# Altium schematic sheet Micro_DSUB_IDC.SchDoc: Micro DSUB to IDC
size 420 x 297 mm; ModifiedBy: -; CreateDate: XX/XX/XXXX; CheckedDate: -; Title2: adapter; DivGrp: CTI; Designer: G.K.
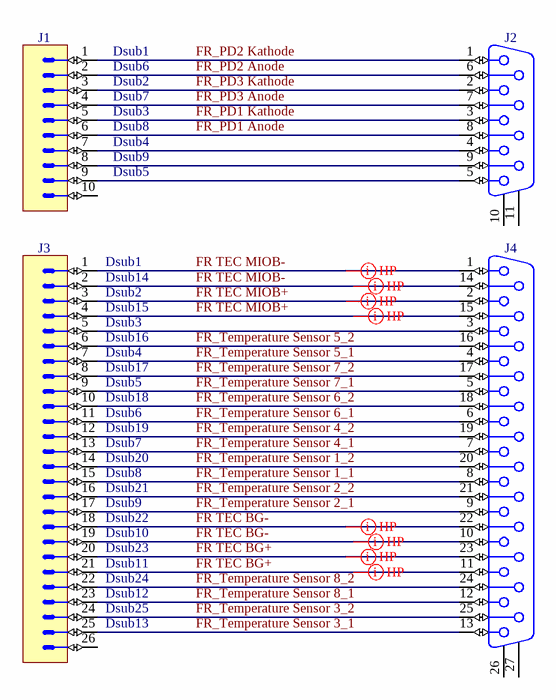
[diagram p0: Micro_DSUB_IDC.SchDoc]

## Parts
J1  Header 10  [3M_N2510-6002RB]  (value not drawn)
J2  MICRO D  [NORCOMP_380-009-213L001]  (value not drawn)
J3  Header 26  [3M_N2526-6002RB]  (value not drawn)
J4  MICRO D  [NORCOMP_380-025-213L001]  (value not drawn)

## Nets
FR TEC BG+: J3.20 J3.21 J4.11 J4.23
FR TEC BG-: J3.18 J3.19 J4.10 J4.22
FR TEC MIOB+: J3.3 J3.4 J4.2 J4.15
FR TEC MIOB-: J3.1 J3.2 J4.1 J4.14
FR_PD1 Anode: J1.6 J2.8
FR_PD1 Kathode: J1.5 J2.3
FR_PD2 Anode: J1.2 J2.6
FR_PD2 Kathode: J1.1 J2.1
FR_PD3 Anode: J1.4 J2.7
FR_PD3 Kathode: J1.3 J2.2
FR_Temperature Sensor 1_1: J3.15 J4.8
FR_Temperature Sensor 1_2: J3.14 J4.20
FR_Temperature Sensor 2_1: J3.17 J4.9
FR_Temperature Sensor 2_2: J3.16 J4.21
FR_Temperature Sensor 3_1: J3.25 J4.13
FR_Temperature Sensor 3_2: J3.24 J4.25
FR_Temperature Sensor 4_1: J3.13 J4.7
FR_Temperature Sensor 4_2: J3.12 J4.19
FR_Temperature Sensor 5_1: J3.7 J4.4
FR_Temperature Sensor 5_2: J3.6 J4.16
FR_Temperature Sensor 6_1: J3.11 J4.6
FR_Temperature Sensor 6_2: J3.10 J4.18
FR_Temperature Sensor 7_1: J3.9 J4.5
FR_Temperature Sensor 7_2: J3.8 J4.17
FR_Temperature Sensor 8_1: J3.23 J4.12
FR_Temperature Sensor 8_2: J3.22 J4.24
NetJ1_7: J1.7 J2.4
NetJ1_8: J1.8 J2.9
NetJ1_9: J1.9 J2.5
NetJ3_5: J3.5 J4.3

Not connected (* = marked no-connect by the designer): J1 10; J2 10 11; J3 26; J4 26 27

## Layout directives
net class HP: FR TEC BG+, FR TEC BG-, FR TEC MIOB+, FR TEC MIOB-

## Notes on the sheet
- (near J1) Dsub1
- (near J1) Dsub2
- (near J1) Dsub6
- (near J1) Dsub7
- (near J1) Dsub3
- (near J1) Dsub4
- (near J1) Dsub5
- (near J1) Dsub8
- (near J1) Dsub9
- (near J3) Dsub1
- (near J3) Dsub2
- (near J3) Dsub3
- (near J3) Dsub14
- (near J3) Dsub15
- (near J3) Dsub4
- (near J3) Dsub5
- (near J3) Dsub16
- (near J3) Dsub17
- (near J3) Dsub18
- (near J3) Dsub6
- (near J3) Dsub7
- (near J3) Dsub8
- (near J3) Dsub19
- (near J3) Dsub20
- (near J3) Dsub9
- (near J3) Dsub10
- (near J3) Dsub21
- (near J3) Dsub22
- (near J3) Dsub23
- (near J3) Dsub11
- (near J3) Dsub12
- (near J3) Dsub13
- (near J3) Dsub24
- (near J3) Dsub25
- Project/Equipment
- Document
- Designer
- Drawn by
- Check.by
- Copyright Creotech Instruments SA 2014.
  This documentation describes Open Hardware and is licensed under the CERN OHL v.1.1. You may redistribute and modify this documentation under the terms of the CERN OHL v.1.1. (http://ohwr.org/CERNOHL). This documentation is distributed WITHOUT ANY EXPRESS OR IMPLIED WARRANTY, INCLUDING OF MERCHANTABILITY, SATISFACTORY QUALITY AND FITNESS FOR A PARTICULAR PURPOSE. Please see the CERN OHL v.1.1 for applicable conditions.
- File
- Last Mod.
- Print Date
- Sheet
- Size
- A3
- of
- Rev

## Library data of the parts
J1 = 3M_N2510-6002RB: Connector 10 Male; Part Description: 10 Contacts, Straight .100'' x .100'' Low Profile Four-Wall Header, 2500 Series; Manufacturer: 3M; PressFit: No; Part Number: 3M_N2510-6002RB; Component Kind: Standard; Component Type: Standard; Pin Count: 10; Family: Header 10; Mounted: Yes; Socket: No; SMD: No; Sense: No; Status: None; Manufacturer Part Number: N2510-6002RB; ComponentHeight: 10.03mm; HelpURL: \\cern.ch\dfs\Applications\Altium\Datasheets\3M_N2510-6002RB.pdf; Author: CERN DEM JLC; CreateDate: 11.02.2009; LatestRevisionDate: 11.08.2009
J2 = NORCOMP_380-009-213L001: Connector D-sub 9 Female; Part Description: 9 Contacts, Pitch 1.27, MICRO-D VERTICAL PCB MOUNT, 380 Series; PressFit: No; Part Number: NORCOMP_380-009-213L001; Component Kind: Standard; Component Type: Standard; Pin Count: 11; Family: MICRO D; Mounted: Yes; Socket: No; SMD: No; Sense: No; Status: Not Recommended; Manufacturer: NORCOMP; Manufacturer Part Number: 380-009-213L001; ComponentHeight: 8.5mm; HelpURL: \\cern.ch\dfs\Applications\Altium\Datasheets\NORCOMP_380-XXX-213L001.pdf; Author: CERN DEM HF; CreateDate: 19.05.2022; LatestRevisionDate: 19.05.2022
J3 = 3M_N2526-6002RB: Connector 26 Male; Part Description: 26 Contacts, Straight .100'' x .100'' Low Profile Four-Wall Header, 2500 Series; Manufacturer: 3M; PressFit: No; Part Number: 3M_N2526-6002RB; Component Kind: Standard; Component Type: Standard; Pin Count: 26; Family: Header 26; Mounted: Yes; Socket: No; SMD: No; Sense: No; Status: None; Manufacturer Part Number: N2526-6002RB; ComponentHeight: 10.03mm; HelpURL: \\cern.ch\dfs\Applications\Altium\Datasheets\3M_N2526-6002RB.pdf; Author: CERN DEM JLC; CreateDate: 11.02.2009; LatestRevisionDate: 11.08.2009
J4 = NORCOMP_380-025-213L001: Connector D-sub 25 Female; Part Description: 25 Contacts, Pitch 1.27, MICRO-D VERTICAL PCB MOUNT, 380 Series; PressFit: No; Part Number: NORCOMP_380-025-213L001; Component Kind: Standard; Component Type: Standard; Pin Count: 27; Family: MICRO D; Mounted: Yes; Socket: No; SMD: No; Sense: No; Status: Not Recommended; Manufacturer: NORCOMP; Manufacturer Part Number: 380-025-213L001; ComponentHeight: 8.5mm; HelpURL: \\cern.ch\dfs\Applications\Altium\Datasheets\NORCOMP_380-xxx-213L001.pdf; Author: CERN DEM HF; CreateDate: 20.05.2022; LatestRevisionDate: 20.05.2022